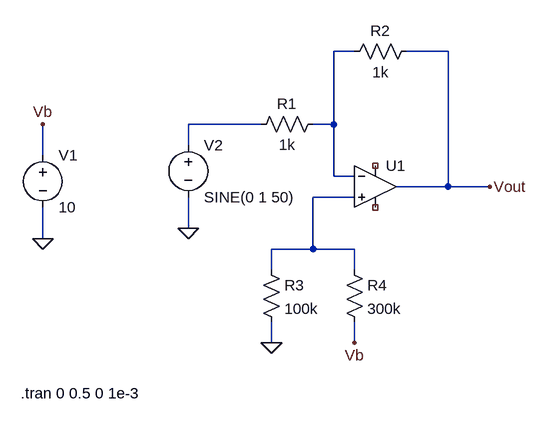
[diagram p0: schematic test_amp_with_offset.asc]
test_amp_with_offset.asc, the LTspice schematic file:
Version 4
SHEET 1 880 680
WIRE 96 -80 64 -80
WIRE 240 -80 176 -80
WIRE -48 32 -160 32
WIRE 64 32 64 -80
WIRE 64 32 32 32
WIRE -160 64 -160 32
WIRE -384 80 -384 32
WIRE 64 112 64 32
WIRE 96 112 64 112
WIRE 240 128 240 -80
WIRE 240 128 160 128
WIRE 304 128 240 128
WIRE 96 144 32 144
WIRE -160 192 -160 144
WIRE -384 208 -384 160
WIRE 32 224 32 144
WIRE 32 224 -32 224
WIRE 96 224 32 224
WIRE -32 256 -32 224
WIRE 96 256 96 224
WIRE -32 368 -32 336
WIRE 96 368 96 336
FLAG -384 208 0
FLAG -384 32 Vb
FLAG -160 192 0
FLAG -32 368 0
FLAG 96 368 Vb
FLAG 304 128 Vout
SYMBOL OpAmps\\UniversalOpAmp 128 128 R0
SYMATTR InstName U1
SYMBOL voltage -384 64 R0
WINDOW 123 0 0 Left 0
WINDOW 39 0 0 Left 0
SYMATTR InstName V1
SYMATTR Value 10
SYMBOL res 48 16 R90
WINDOW 0 0 56 VBottom 2
WINDOW 3 32 56 VTop 2
SYMATTR InstName R1
SYMATTR Value 1k
SYMBOL res 192 -96 R90
WINDOW 0 0 56 VBottom 2
WINDOW 3 32 56 VTop 2
SYMATTR InstName R2
SYMATTR Value 1k
SYMBOL voltage -160 48 R0
WINDOW 123 0 0 Left 0
WINDOW 39 0 0 Left 0
SYMATTR InstName V2
SYMATTR Value SINE(0 1 50)
SYMBOL res -48 240 R0
SYMATTR InstName R3
SYMATTR Value 100k
SYMBOL res 80 240 R0
SYMATTR InstName R4
SYMATTR Value 300k
TEXT -418 446 Left 2 !.tran 0 0.5 0 1e-3

The netlist it stands for:
* test_amp_with_offset.asc
XU1 N003 N001 NC_01 NC_02 Vout level1 Avol=1Meg GBW=10Meg Vos=0 En=0 Enk=0 In=0 Ink=0 Rin=500Meg  ; pins In+ In- V+ V- OUT
V1 Vb 0 10
R1 N001 N002 1k
R2 Vout N001 1k
V2 N002 0 SINE(0 1 50)
R3 N003 0 100k
R4 N003 Vb 300k
.tran 0 0.5 0 1e-3
.lib UniversalOpAmp1.lib
.backanno
.end